# Altium project Kello.PrjPCB
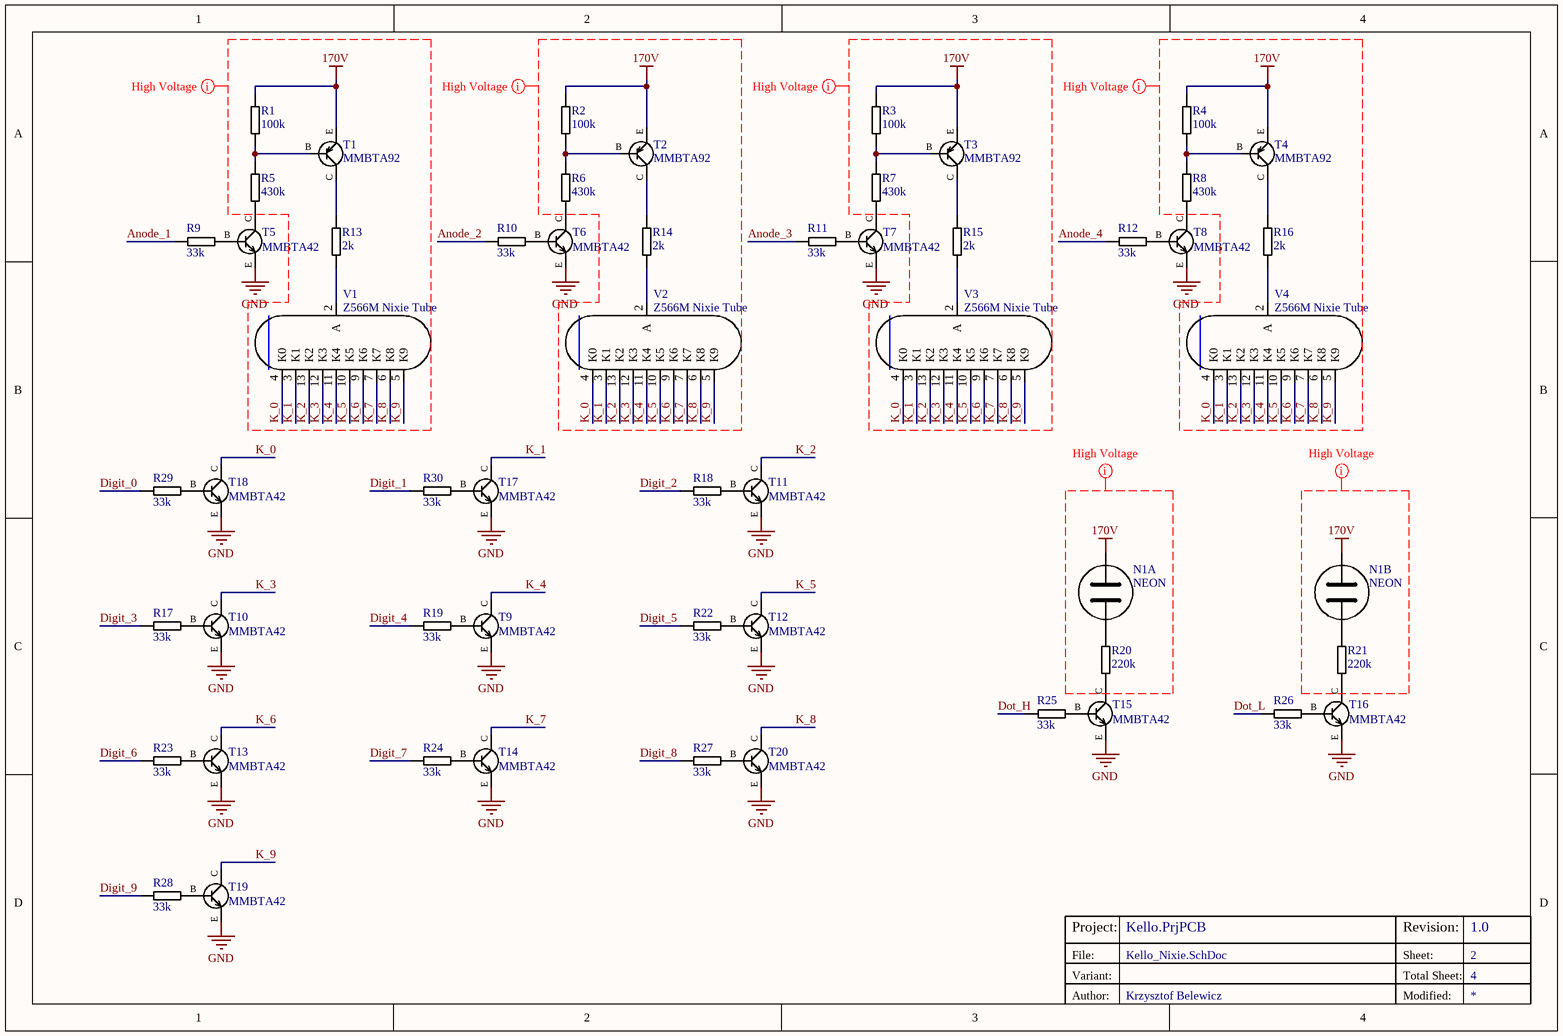
[diagram p0: Kello_Nixie.SchDoc]
4 sheets, 142 parts. Net scope: global (net labels, ports and power ports of the same name join across sheets).
Board file: Kello.PcbDoc
Sheets:
  Kello_Nixie.SchDoc
  Kello_uC.SchDoc
  Kello_Mechanical.SchDoc
  Kello_Nixie_PWR.SchDoc

## Sheet Kello_Nixie.SchDoc
size A4; ApprovedBy: Krzysztof Belewicz; CheckedBy: Krzysztof Belewicz; Author: Krzysztof Belewicz; DrawnBy: Krzysztof Belewicz; Engineer: Krzysztof Belewicz; Revision: 1.0; SheetNumber: 2; SheetTotal: 4

### Parts
N1  NEON  [NEON-9]  (parts A,B of 2)
R1  value 100k  [RESC1608N]  (hidden comment: Resistor)
R2  value 100k  [RESC1608N]  (hidden comment: Resistor)
R3  value 100k  [RESC1608N]  (hidden comment: Resistor)
R4  value 100k  [RESC1608N]  (hidden comment: Resistor)
R5  value 430k  [RESC1608N]  (hidden comment: Resistor)
R6  value 430k  [RESC1608N]  (hidden comment: Resistor)
R7  value 430k  [RESC1608N]  (hidden comment: Resistor)
R8  value 430k  [RESC1608N]  (hidden comment: Resistor)
R9  value 33k  [RESC1608N]  (hidden comment: Resistor)
R10  value 33k  [RESC1608N]  (hidden comment: Resistor)
R11  value 33k  [RESC1608N]  (hidden comment: Resistor)
R12  value 33k  [RESC1608N]  (hidden comment: Resistor)
R13  value 2k  [RESC1608N]  (hidden comment: Resistor)
R14  value 2k  [RESC1608N]  (hidden comment: Resistor)
R15  value 2k  [RESC1608N]  (hidden comment: Resistor)
R16  value 2k  [RESC1608N]  (hidden comment: Resistor)
R17  value 33k  [RESC1608N]  (hidden comment: Resistor)
R18  value 33k  [RESC1608N]  (hidden comment: Resistor)
R19  value 33k  [RESC1608N]  (hidden comment: Resistor)
R20  value 220k  [RESC1608N]  (hidden comment: Resistor)
R21  value 220k  [RESC1608N]  (hidden comment: Resistor)
R22  value 33k  [RESC1608N]  (hidden comment: Resistor)
R23  value 33k  [RESC1608N]  (hidden comment: Resistor)
R24  value 33k  [RESC1608N]  (hidden comment: Resistor)
R25  value 33k  [RESC1608N]  (hidden comment: Resistor)
R26  value 33k  [RESC1608N]  (hidden comment: Resistor)
R27  value 33k  [RESC1608N]  (hidden comment: Resistor)
R28  value 33k  [RESC1608N]  (hidden comment: Resistor)
R29  value 33k  [RESC1608N]  (hidden comment: Resistor)
R30  value 33k  [RESC1608N]  (hidden comment: Resistor)
T1  MMBTA92  [SOT23-3N]
T2  MMBTA92  [SOT23-3N]
T3  MMBTA92  [SOT23-3N]
T4  MMBTA92  [SOT23-3N]
T5  MMBTA42  [SOT23-3N]
T6  MMBTA42  [SOT23-3N]
T7  MMBTA42  [SOT23-3N]
T8  MMBTA42  [SOT23-3N]
T9  MMBTA42  [SOT23-3N]
T10  MMBTA42  [SOT23-3N]
T11  MMBTA42  [SOT23-3N]
T12  MMBTA42  [SOT23-3N]
T13  MMBTA42  [SOT23-3N]
T14  MMBTA42  [SOT23-3N]
T15  MMBTA42  [SOT23-3N]
T16  MMBTA42  [SOT23-3N]
T17  MMBTA42  [SOT23-3N]
T18  MMBTA42  [SOT23-3N]
T19  MMBTA42  [SOT23-3N]
T20  MMBTA42  [SOT23-3N]
V1  Z566M Nixie Tube  [Z566M]
V2  Z566M Nixie Tube  [Z566M]
V3  Z566M Nixie Tube  [Z566M]
V4  Z566M Nixie Tube  [Z566M]

### Nets
170V: N1.2 R1.1 R2.1 R3.1 R4.1 T1.E T2.E T3.E T4.E
GND: T5.E T6.E T7.E T8.E T9.E T10.E T11.E T12.E T13.E T14.E T15.E T16.E T17.E T18.E T19.E T20.E
Anode_1: R9.1
Anode_2: R10.1
Anode_3: R11.1
Anode_4: R12.1
Digit_0: R29.1
Digit_1: R30.1
Digit_2: R18.1
Digit_3: R17.1
Digit_4: R19.1
Digit_5: R22.1
Digit_6: R23.1
Digit_7: R24.1
Digit_8: R27.1
Digit_9: R28.1
Dot_H: R25.1
Dot_L: R26.1
K_0: T18.C V1.4(K0) V2.4(K0) V3.4(K0) V4.4(K0)
K_1: T17.C V1.3(K1) V2.3(K1) V3.3(K1) V4.3(K1)
K_2: T11.C V1.13(K2) V2.13(K2) V3.13(K2) V4.13(K2)
K_3: T10.C V1.12(K3) V2.12(K3) V3.12(K3) V4.12(K3)
K_4: T9.C V1.11(K4) V2.11(K4) V3.11(K4) V4.11(K4)
K_5: T12.C V1.10(K5) V2.10(K5) V3.10(K5) V4.10(K5)
K_6: T13.C V1.9(K6) V2.9(K6) V3.9(K6) V4.9(K6)
K_7: T14.C V1.7(K7) V2.7(K7) V3.7(K7) V4.7(K7)
K_8: T20.C V1.6(K8) V2.6(K8) V3.6(K8) V4.6(K8)
K_9: T19.C V1.5(K9) V2.5(K9) V3.5(K9) V4.5(K9)
NetN1_1: N1.1 R20.1
NetN1_3: N1.3 R21.1
NetR1_2: R1.2 R5.1 T1.B
NetR2_2: R2.2 R6.1 T2.B
NetR3_2: R3.2 R7.1 T3.B
NetR4_2: R4.2 R8.1 T4.B
NetR5_2: R5.2 T5.C
NetR6_2: R6.2 T6.C
NetR7_2: R7.2 T7.C
NetR8_2: R8.2 T8.C
NetR9_2: R9.2 T5.B
NetR10_2: R10.2 T6.B
NetR11_2: R11.2 T7.B
NetR12_2: R12.2 T8.B
NetR13_1: R13.1 T1.C
NetR13_2: R13.2 V1.2(A)
NetR14_1: R14.1 T2.C
NetR14_2: R14.2 V2.2(A)
NetR15_1: R15.1 T3.C
NetR15_2: R15.2 V3.2(A)
NetR16_1: R16.1 T4.C
NetR16_2: R16.2 V4.2(A)
NetR17_2: R17.2 T10.B
NetR18_2: R18.2 T11.B
NetR19_2: R19.2 T9.B
NetR20_2: R20.2 T15.C
NetR21_2: R21.2 T16.C
NetR22_2: R22.2 T12.B
NetR23_2: R23.2 T13.B
NetR24_2: R24.2 T14.B
NetR25_2: R25.2 T15.B
NetR26_2: R26.2 T16.B
NetR27_2: R27.2 T20.B
NetR28_2: R28.2 T19.B
NetR29_2: R29.2 T18.B
NetR30_2: R30.2 T17.B

### Layout directives
rule Clearance Constraint [Clearance = 19.685mil]; net class HIGH VOLTAGE: 170V, K_0, K_1, K_2, K_3, K_4, K_5, K_6, K_7, K_8, K_9

### Notes on the sheet
- Project:
- Variant:
- File:
- Sheet:
- Revision:
- Total Sheet:
- Author:
- Modified:

### Library data of the parts
N1 = NEON-9: Neon Tube; Supplier 1: TME; Supplier Part Number 1: NEON-9
R1-R4 = Resistor: Manufacturer 1: VISHAY; Manufacturer Part Number 1: CRCW0603100KFKEA; Tolerance: 1%; Power: 0.1W; Supplier 1: TME; Supplier Part Number 1: CRCW0603100KFKEA
R5-R12 R17-R30 = Resistor: Tolerance: 1%; Power: *; Supplier 1: TME; Supplier 2: *
  R5-R8: Supplier Part Number 1: SMD0603-430k
  R9-R12 R17-R19 R22-R30: Supplier Part Number 1: SMD0603-33k
  R20 R21: Supplier Part Number 1: SMD0603-220k
R13-R16 = Resistor: Manufacturer 1: ROYAL OHM; Manufacturer Part Number 1: 0603SAF2001T5E; Tolerance: 1%; Power: 0.1W; Supplier 1: TME; Supplier Part Number 1: SMD0603-2K-1%
T1-T4 = 2N5087: PNP Transistor; pin to pad: B>1 C>3 E>2; Supplier 1: TME; Supplier Part Number 1: MMBTA92
T5-T20 = 2N3707: NPN Transistor; pin to pad: B>1 C>3 E>2; Supplier 1: TME; Supplier Part Number 1: MMBTA42LT1G
V1-V4 = Z566M

## Sheet Kello_uC.SchDoc
size A4; ApprovedBy: Krzysztof Belewicz; CheckedBy: Krzysztof Belewicz; Author: Krzysztof Belewicz; DrawnBy: Krzysztof Belewicz; Engineer: Krzysztof Belewicz; Revision: 1.0; SheetNumber: 1; SheetTotal: 4
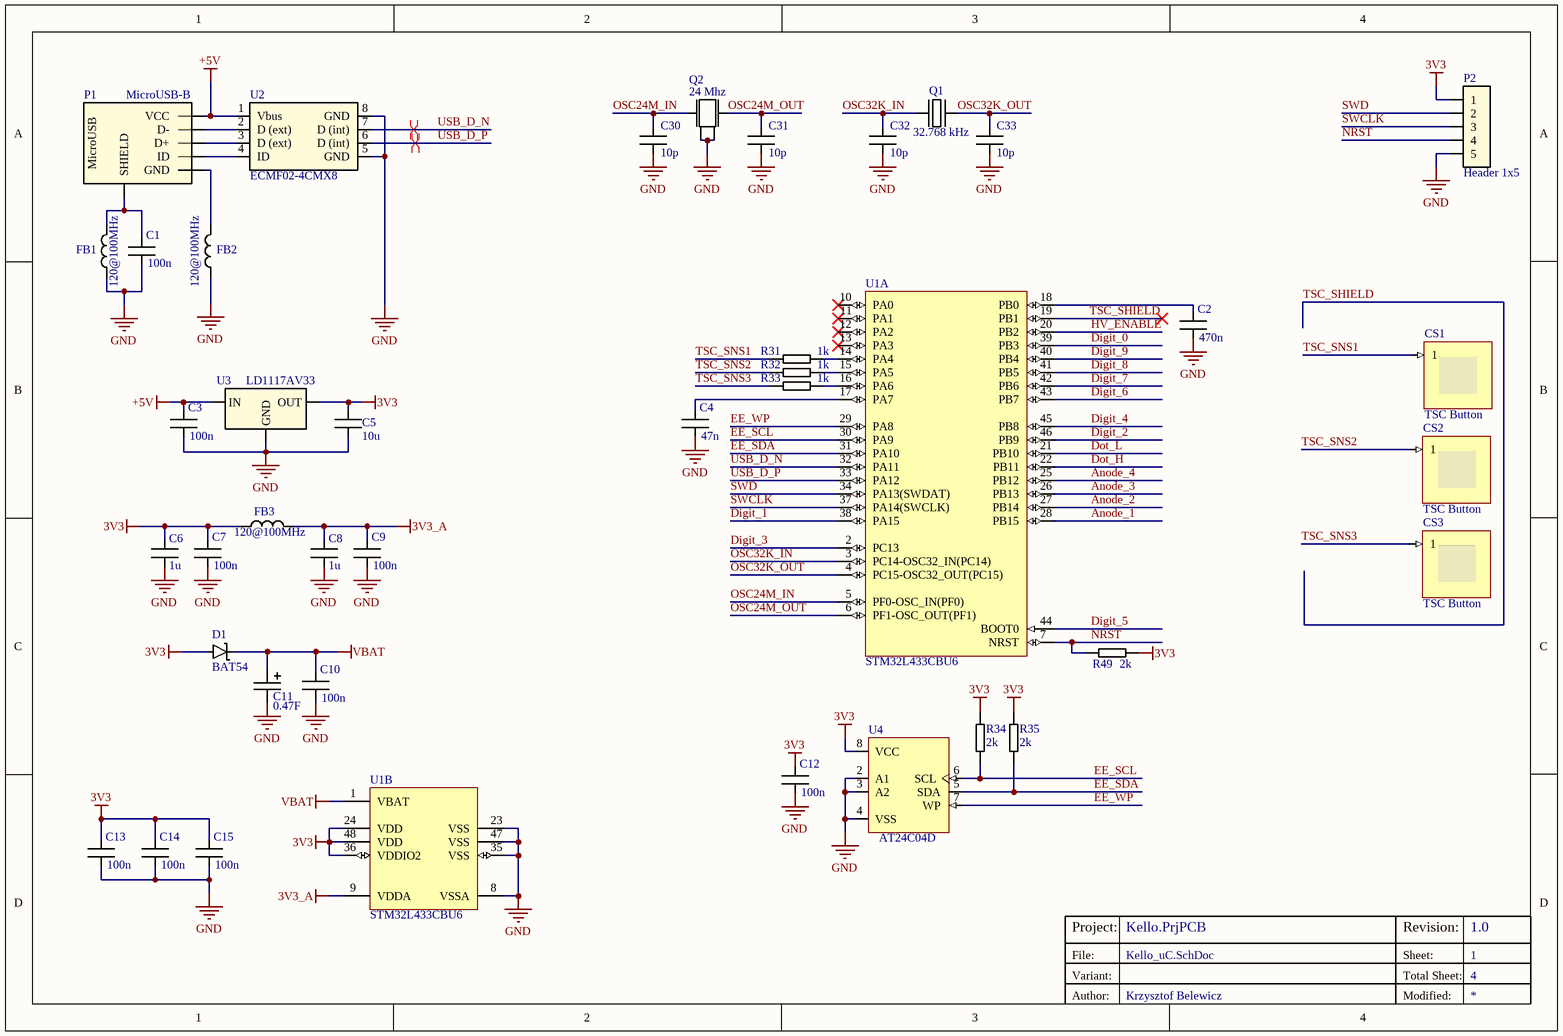
[diagram p1: Kello_uC.SchDoc]

### Parts
C1  value 100n  [CAPC1608N]  (hidden comment: Capacitor)
C2  value 470n  [CAPC1608N]  (hidden comment: Capacitor)
C3  value 100n  [CAPC1608N]  (hidden comment: Capacitor)
C4  value 47n  [CAPC1608N]  (hidden comment: Capacitor)
C5  value 10u  [CAPC1608N]  (hidden comment: Capacitor)
C6  value 1u  [CAPC1608N]  (hidden comment: Capacitor)
C7  value 100n  [CAPC1608N]  (hidden comment: Capacitor)
C8  value 1u  [CAPC1608N]  (hidden comment: Capacitor)
C9  value 100n  [CAPC1608N]  (hidden comment: Capacitor)
C10  value 100n  [CAPC1608N]  (hidden comment: Capacitor)
C11  0.47F  [FGH0V474ZF]
C12  value 100n  [CAPC1608N]  (hidden comment: Capacitor)
C13  value 100n  [CAPC1608N]  (hidden comment: Capacitor)
C14  value 100n  [CAPC1608N]  (hidden comment: Capacitor)
C15  value 100n  [CAPC1608N]  (hidden comment: Capacitor)
C30  10p  [CAPC1005N]
C31  10p  [CAPC1005N]
C32  10p  [CAPC1005N]
C33  10p  [CAPC1005N]
CS1  TSC Button  (no BOM)
CS2  TSC Button  (no BOM)
CS3  TSC Button  (no BOM)
D1  BAT54  [SOD-523F]
FB1  value 120@100MHz  [INDC1608N]  (hidden comment: Ferrite Bead)
FB2  value 120@100MHz  [INDC1608N]  (hidden comment: Ferrite Bead)
FB3  value 120@100MHz  [INDC1608N]  (hidden comment: Ferrite Bead)
P1  MicroUSB-B  [MicroUSB-B (47346-0001)]
P2  Header 1x5  [Header 1x5, Male, 2.54mm, Straight, THT]
Q1  value 32.768 kHz  [IL3X2]  (hidden comment: Crystal 2 pin)
Q2  value 24 Mhz  [CFPX-5]  (hidden comment: 24Mhz)
R31  value 1k  [RESC1608N]  (hidden comment: Resistor)
R32  value 1k  [RESC1608N]  (hidden comment: Resistor)
R33  value 1k  [RESC1608N]  (hidden comment: Resistor)
R34  value 2k  [RESC1608N]  (hidden comment: Resistor)
R35  value 2k  [RESC1608N]  (hidden comment: Resistor)
R49  value 2k  [RESC1608N]  (hidden comment: Resistor)
U1  STM32L433CBU6  [STM-UFQFPN48_L]  (parts A,B of 2)
U2  ECMF02-4CMX8  [uQFN-8]
U3  LD1117AV33  [SOT223_N]
U4  AT24C04D  [DFN-MC8]

### Nets
3V3: C5.2 C6.2 C7.2 C12.2 C13.2 C14.2 C15.2 D1.A FB3.1 P2.1 R34.1 R35.1 R49.2 U1.24(VDD) U1.36(VDDIO2) U1.48(VDD) U3.2(OUT) U4.8(VCC)
3V3_A: C8.2 C9.2 FB3.2 U1.9(VDDA)
+5V: C3.2 P1.1(VCC) U2.1(Vbus) U3.3(IN)
GND: C1.1 C2.1 C3.1 C4.1 C5.1 C6.1 C7.1 C8.1 C9.1 C10.1 C11.2 C12.1 C13.1 C14.1 C15.1 C30.1 C31.1 C32.1 C33.1 FB1.2 FB2.2 P2.5 Q2.2 Q2.4 U1.8(VSSA) U1.23(VSS) U1.35(VSS) U1.47(VSS) U2.5(GND) U2.8(GND) U3.1(GND) U4.2(A1) U4.3(A2) U4.4(VSS)
VBAT: C10.2 C11.1 D1.K U1.1(VBAT)
Anode_1: U1.28(PB15)
Anode_2: U1.27(PB14)
Anode_3: U1.26(PB13)
Anode_4: U1.25(PB12)
Digit_0: U1.39(PB3)
Digit_1: U1.38(PA15)
Digit_2: U1.46(PB9)
Digit_3: U1.2(PC13)
Digit_4: U1.45(PB8)
Digit_5: U1.44(BOOT0)
Digit_6: U1.43(PB7)
Digit_7: U1.42(PB6)
Digit_8: U1.41(PB5)
Digit_9: U1.40(PB4)
Dot_H: U1.22(PB11)
Dot_L: U1.21(PB10)
EE_SCL: R34.2 U1.30(PA9) U4.6(SCL)
EE_SDA: R35.2 U1.31(PA10) U4.5(SDA)
EE_WP: U1.29(PA8) U4.7(WP)
HV_ENABLE: U1.20(PB2)
NRST: P2.4 R49.1 U1.7(NRST)
OSC24M_IN: C30.2 Q2.1 U1.5(PF0-OSC_IN(PF0))
OSC24M_OUT: C31.2 Q2.3 U1.6(PF1-OSC_OUT(PF1))
OSC32K_IN: C32.2 Q1.1 U1.3(PC14-OSC32_IN(PC14))
OSC32K_OUT: C33.2 Q1.2 U1.4(PC15-OSC32_OUT(PC15))
SWCLK: P2.3 U1.37(PA14(SWCLK))
SWD: P2.2 U1.34(PA13(SWDAT))
TSC_SHIELD: U1.19(PB1)
TSC_SNS1: CS1.1 R31.1
TSC_SNS2: CS2.1 R32.1
TSC_SNS3: CS3.1 R33.1
USB_D_N: U1.32(PA11) U2.7(D_(int))
USB_D_P: U1.33(PA12) U2.6(D_(int))
NetC1_2: C1.2 FB1.1 P1.6(SHIELD)
NetC2_2: C2.2 U1.18(PB0)
NetC4_2: C4.2 U1.17(PA7)
NetFB2_1: FB2.1 P1.5(GND)
NetP1_2: P1.2(D-) U2.2(D_(ext))
NetP1_3: P1.3(D+) U2.3(D_(ext))
NetP1_4: P1.4(ID) U2.4(ID)
NetR31_2: R31.2 U1.14(PA4)
NetR32_2: R32.2 U1.15(PA5)
NetR33_2: R33.2 U1.16(PA6)

Not connected (* = marked no-connect by the designer): U1 10(PA0)* 11(PA1)* 12(PA2)* 13(PA3)*

### Layout directives
differential pair: USB_D_N, USB_D_P

### Notes on the sheet
- Project:
- Variant:
- File:
- Sheet:
- Revision:
- Total Sheet:
- Author:
- Modified:
- (in symbol 47346-0001) MicroUSB

### Library data of the parts
C1 C3 C7 C9 C10 C12-C15 = Capacitor: Manufacturer Part Number 1: CL10F104ZA8NNNC; Manufacturer 1: SAMSUNG; Tolerance: -20/+80%; MaxVoltage: 25V; Supplier 1: TME; Supplier Part Number 1: CL10F104ZA8NNNC
C2 = Capacitor: Manufacturer Part Number 1: 0603B474K100CT; Manufacturer 1: WALSIN; Tolerance: 10%; MaxVoltage: 10V; Supplier 1: Farnell; Supplier Part Number 1: 2524844
C4 = Capacitor: Manufacturer Part Number 1: VJ0603Y473KXJCW1BC; Manufacturer 1: VISHAY; Tolerance: 10%; MaxVoltage: 16V; Supplier 1: TME; Supplier Part Number 1: VJ0603Y473KXJCW1BC
C5 = Capacitor: Manufacturer Part Number 1: GRM188R60J106ME47D; Manufacturer 1: MURATA; Tolerance: 20%; MaxVoltage: 6.3V; Supplier 1: TME; Supplier Part Number 1: GRM188R60J106ME47D
C6 C8 = Capacitor: Manufacturer Part Number 1: GCM188R71E105KA64D; Manufacturer 1: MURATA; Tolerance: 10%; MaxVoltage: 25V; Supplier 1: TME; Supplier Part Number 1: GCM188R71E105KA64D
C11 = FGH0V474ZF: Kondensator: elektrolityczny; 0.47F; 3,5VDC; ESR:25Ω; SMD; -20÷+80%; Manufacturer 1: KEMET; Max Voltage: 3.5V; ESR: 25Ohm; Supplier 1: TME; Manufacturer Part Number 1: FGH0V474ZF; Supplier Part Number 1: FGH0V474ZF; Value: 0.47F
C30-C33 = Capacitor: Manufacturer Part Number 1: VJ0603A100FXACW1BC; Manufacturer 1: VISHAY; Tolerance: 1%; MaxVoltage: 50V; Supplier 1: Farnell; Supplier 2: TME; Value: 10p; Supplier Part Number 1: 2896354; Manufacturer 2: VISHAY; Manufacturer Part Number 2: VJ0603A100FXACW1BC; Supplier Part Number 2: VJ0603A100FXACW1BC
CS1-CS3 = QTouchButton: QTouch Button; ConfiguratorName: ATMEL_TOUCH; ConfigurationParameters: {}__sensorid[1]{}width[15]{}height[15]{}
D1 = BAT54XV2: Fairchild BAT54XV2, Schottky, 200mA, 30V; Supplier 1: Farnell; Supplier Part Number 1: 2322476; Forward Current: 200mA; Max Reverse Voltage: 30V; Manufacturer: Fairchild; Manufacturer Part Number: BAT54XV2; Supplier 2: RS-Components; Supplier Part Number 2: 690-0029
FB1-FB3 = Inductor: Max Current: 3A; Tolerance: *; Supplier 1: TME; Supplier 2: *; Supplier Part Number 1: BLM18KG121TN1D
P1 = 47346-0001: Molex MicroUSB-B, SMD (P/N 47346-0001); Manufacturer Part Number 1: 473460001; Supplier 1: TME; Supplier Part Number 1: MX-47346-0001; Manufacturer 1: MOLEX
P2 = Header 1x5: Pin header, 1x5, 2.54mm; Supplier Part Number 1: *; Supplier 1: *
Q1 = Crystal 2 pin: Manufacturer 1: ILSI; Manufacturer Part Number 1: IL3X2-HX5F12.5-32.768KHZ; Supplier Part Number 1: IL3X2-HX5F12.5-32.768KHZ; Supplier 1: TME
Q2 = Crystal 4 pin: Manufacturer Part Number 1: 3225-24M-SR; Manufacturer 1: SR PASSIVES; Supplier 1: TME; Supplier Part Number 1: 3225-24M-SR
R31-R33 = Resistor: Manufacturer 1: ROYAL OHM; Manufacturer Part Number 1: 0603SAF1001T5E; Tolerance: 1%; Power: 0.1W; Supplier 1: TME; Supplier Part Number 1: SMD0603-1K-1%
R34 R35 R49 = Resistor: as R13 on sheet Kello_Nixie; Supplier 1: TME; Supplier Part Number 1: SMD0603-2K-1%
U1 = STM32L433CBU6: ARM Cortex-M4 32-bit MCU, 128 KB Flash, 64 KB Internal RAM, 38 I/Os, 48-pin UFQFPN, -40 to 85 degC; FLASH Size (Prog) (kB): 128; I/Os (High Current): 38; Internal RAM Size (kB): 64; Operating Frequency(F) (Processor speed) (MHz): 48; Packing: Tray; Supply Voltage(Vcc) min (V): 2; DatasheetVersion: Rev. 3; PackageVersion: Rev. 6, 06/2013; PackageReference: UFQFPN48; PackageDescription: 48-Pin Low Profile Quad Flat Package, 7 x 7 mm Body, 0.5 mm Pitch; Supplier 1: Farnell; Supplier Part Number 1: 2855693; Core: ARM Cortex-M4; Mounting Technology: Surface Mount; PartNumber: STM32L433CBU6; ComponentLink1Description: Manufacturer URL; ComponentLink1URL: http://www.st.com/web/en/home.html; ComponentLink3Description: Package Specification; ComponentLink3URL: http://www.st.com/st-web-ui/static/active/en/resource/technical/document/datasheet/DM00058181.pdf
U2 = ECMF02-4CMX8: STMicroelectronics Common Mode Filter with ESD protection, USB compatible; Supplier 1: Farnell; Supplier Part Number 1: 2629721; Manufacturer: STMicroelectronics; Manufacturer Part Number: ECMF02-4CMX8
U3 = LD1117AS33TR: Stabilizator napięcia; LDO, liniowy, nieregulowany; 3,3V; 1A; SMD; Manufacturer 1: ST MICROELECTRONICS; Output Voltage: 3.3V; Supplier Part Number 1: LD1117AS33; Supplier 1: TME; Max Current: 1A; Manufacturer Part Number 1: LD1117AS33TR
U4 = AT24C04D-MAHM-T: 4Kbit, 1MHz, 1.7V-3.6V, I2C Serial EEPROM, 8-Pin DFN, Industrial Temperature, Tape and Reel; Manufacturer 1: MICROCHIP; PackageReference: DFN-MC8; Manufacturer Part Number 1: AT24C04D-MAHM-T; Supplier 1: TME; Supplier Part Number 1: AT24C04D-MAHM-T

## Sheet Kello_Mechanical.SchDoc
size A4; ApprovedBy: Krzysztof Belewicz; CheckedBy: Krzysztof Belewicz; Author: Krzysztof Belewicz; DrawnBy: Krzysztof Belewicz; Engineer: Krzysztof Belewicz; Revision: 1.0; SheetNumber: 4; SheetTotal: 4
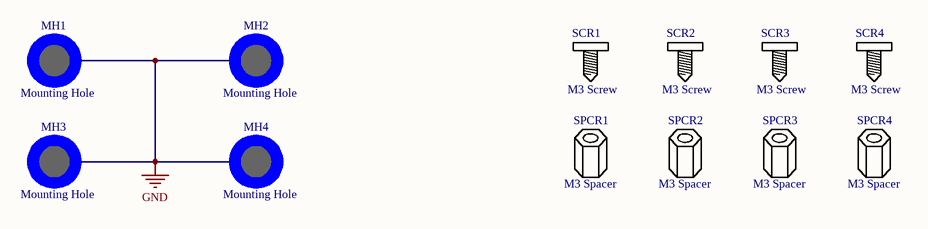
[diagram p2: Kello_Mechanical.SchDoc]

### Parts
MH1  Mounting Hole  [MH-M3_Copper]  (no BOM)
MH2  Mounting Hole  [MH-M3_Copper]  (no BOM)
MH3  Mounting Hole  [MH-M3_Copper]  (no BOM)
MH4  Mounting Hole  [MH-M3_Copper]  (no BOM)
SCR1  M3 Screw  (mechanical)
SCR2  M3 Screw  (mechanical)
SCR3  M3 Screw  (mechanical)
SCR4  M3 Screw  (mechanical)
SPCR1  M3 Spacer  (mechanical)
SPCR2  M3 Spacer  (mechanical)
SPCR3  M3 Spacer  (mechanical)
SPCR4  M3 Spacer  (mechanical)

### Nets
GND: MH1.MH MH2.MH MH3.MH MH4.MH

### Notes on the sheet
- Project:
- Variant:
- File:
- Sheet:
- Revision:
- Total Sheet:
- Author:
- Modified:

### Library data of the parts
MH1-MH4 = MH: M3 mounting hole
SCR1-SCR4 = SCREW: Supplier 1: *; Manufacturer 1: *; Supplier Part Number 1: *; Manufacturer Part Number 1: *
SPCR1-SPCR4 = SPCR: Supplier 1: *; Manufacturer 1: *; Supplier Part Number 1: *; Manufacturer Part Number 1: *

## Sheet Kello_Nixie_PWR.SchDoc
size A4; ApprovedBy: Krzysztof Belewicz; CheckedBy: Krzysztof Belewicz; Author: Krzysztof Belewicz; DrawnBy: Krzysztof Belewicz; Engineer: Krzysztof Belewicz; Revision: 1.0; SheetNumber: 3; SheetTotal: 4
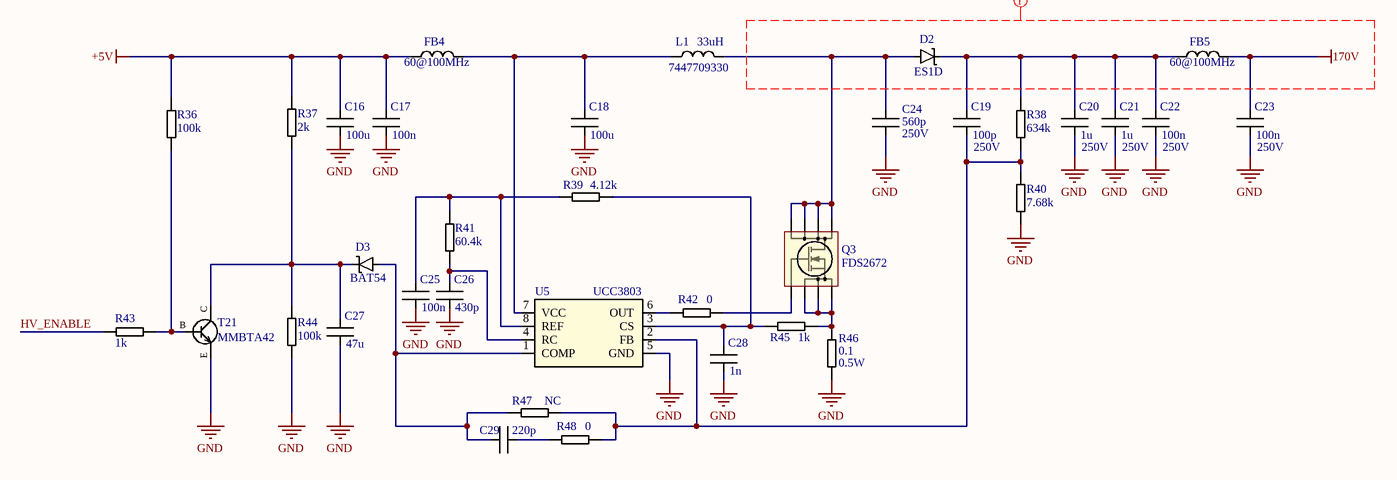
[diagram p3: Kello_Nixie_PWR.SchDoc]

### Parts
C16  value 100u  [CAPC4532N]  (hidden comment: Capacitor)
C17  value 100n  [CAPC1608N]  (hidden comment: Capacitor)
C18  value 100u  [CAPC4532N]  (hidden comment: Capacitor)
C19  value 100p  MaxVoltage: 250V  [CAPC1608N]  (hidden comment: Capacitor)
C20  value 1u  MaxVoltage: 250V  [CAPC4532N]  (hidden comment: Capacitor)
C21  value 1u  MaxVoltage: 250V  [CAPC4532N]  (hidden comment: Capacitor)
C22  value 100n  MaxVoltage: 250V  [CAPC3216N]  (hidden comment: Capacitor)
C23  value 100n  MaxVoltage: 250V  [CAPC3216N]  (hidden comment: Capacitor)
C24  value 560p  MaxVoltage: 250V  [CAPC1608N]  (hidden comment: Capacitor)
C25  value 100n  [CAPC1608N]  (hidden comment: Capacitor)
C26  value 430p  [CAPC1608N]  (hidden comment: Capacitor)
C27  value 47u  [CAPC3225N]  (hidden comment: Capacitor)
C28  value 1n  [CAPC1608N]  (hidden comment: Capacitor)
C29  value 220p  [CAPC1608N]  (hidden comment: Capacitor)
D2  ES1D  [SUB-SMA]
D3  BAT54  [SOD-523F]
FB4  value 60@100MHz  [INDC1608N]  (hidden comment: Ferrite Bead)
FB5  value 60@100MHz  [INDC1608N]  (hidden comment: Ferrite Bead)
L1  7447709330  value 33uH  [WE_PD]
Q3  FDS2672  [SO8_N]
R36  value 100k  [RESC1608N]  (hidden comment: Resistor)
R37  value 2k  [RESC1608N]  (hidden comment: Resistor)
R38  value 634k  [RESC3216N]  (hidden comment: Resistor)
R39  value 4.12k  [RESC1608N]  (hidden comment: Resistor)
R40  value 7.68k  [RESC3216N]  (hidden comment: Resistor)
R41  value 60.4k  [RESC1608N]  (hidden comment: Resistor)
R42  value 0  [RESC1608N]  (hidden comment: Resistor)
R43  value 1k  [RESC1608N]  (hidden comment: Resistor)
R44  value 100k  [RESC1608N]  (hidden comment: Resistor)
R45  value 1k  [RESC1608N]  (hidden comment: Resistor)
R46  value 0.1  Power: 0.5W  [RESC3216N]  (hidden comment: Resistor)
R47  value NC  [RESC1608N]  (hidden comment: Resistor)
R48  value 0  [RESC1608N]  (hidden comment: Resistor)
T21  MMBTA42  [SOT23-3N]
U5  UCC3803  [SOIC8+PAD (SOIC127P600X170_HS-9N)]

### Nets
170V: C23.2 FB5.2
+5V: C16.2 C17.2 FB4.1 R36.1 R37.1
GND: C16.1 C17.1 C18.1 C20.1 C21.1 C22.1 C23.1 C24.1 C25.1 C26.1 C27.1 C28.1 R40.2 R44.2 R46.2 T21.E U5.5(GND)
HV_ENABLE: R43.1
NetC18_2: C18.2 FB4.2 L1.1 U5.7(VCC)
NetC19_1: C19.1 R38.2 R40.1 R47.2 R48.2 U5.2(FB)
NetC19_2: C19.2 C20.2 C21.2 C22.2 D2.K FB5.1 R38.1
NetC24_2: C24.2 D2.A L1.2 Q3.5(D) Q3.6(D) Q3.7(D) Q3.8(D)
NetC25_2: C25.2 R39.1 R41.1 U5.8(REF)
NetC26_2: C26.2 R41.2 U5.4(RC)
NetC27_2: C27.2 D3.K R37.2 R44.1 T21.C
NetC28_2: C28.2 R39.2 R45.1 U5.3(CS)
NetC29_1: C29.1 R48.1
NetC29_2: C29.2 D3.A R47.1 U5.1(COMP)
NetQ3_1: Q3.1(S) Q3.2(S) Q3.3(S) R45.2 R46.1
NetQ3_4: Q3.4(G) R42.2
NetR36_2: R36.2 R43.2 T21.B
NetR42_1: R42.1 U5.6(OUT)

### Layout directives
rule Clearance Constraint [Clearance = 19.685mil]; net class HIGH VOLTAGE: 170V

### Notes on the sheet
- Project:
- Variant:
- File:
- Sheet:
- Revision:
- Total Sheet:
- Author:
- Modified:

### Library data of the parts
C16 C18 = Capacitor: Manufacturer Part Number 1: C4532X5R1A107M280KC; Manufacturer 1: TDK; Tolerance: 20%; MaxVoltage: 10V; Supplier 1: Farnell; Supplier Part Number 1: 2525204
C17 C25 = Capacitor: as C1 on sheet Kello_uC; Supplier 1: TME; Supplier Part Number 1: CL10F104ZA8NNNC
C19 = Capacitor: Manufacturer Part Number 1: 885342006003; Manufacturer 1: WURTH ELEKTRONIK; Tolerance: 5%; Supplier 1: Farnell; Supplier Part Number 1: 2812519
C20 C21 = Capacitor: Manufacturer Part Number 1: CGA8P3X7T2E105K250KA; Manufacturer 1: TDK; Tolerance: 10%; Supplier 1: Farnell; Supplier Part Number 1: 2435499
C22 C23 = Capacitor: Manufacturer Part Number 1: C1206C104KARECAUTO; Manufacturer 1: KEMET; Tolerance: 10%; Supplier 1: Farnell; Supplier Part Number 1: 2852360
C24 = Capacitor: Manufacturer Part Number 1: C0603C561JAGACAUTO; Manufacturer 1: KEMET; Tolerance: 5%; Supplier 1: Farnell; Supplier Part Number 1: 2810275
C26 = Capacitor: Manufacturer 1: KEMET; Manufacturer Part Number 1: C0603C431J5GACTU; Tolerance: 5%; MaxVoltage: 50V; Supplier 1: Farnell; Supplier Part Number 1: 2821196
C27 = Capacitor: Manufacturer 1: KEMET; Manufacturer Part Number 1: C1210C476M4PACTU; Tolerance: 20%; MaxVoltage: 16V; Supplier 1: Farnell; Supplier Part Number 1: 1838761
C28 = Capacitor: Manufacturer Part Number 1: VJ0603Y102KXACW1BC; Manufacturer 1: VISHAY; Tolerance: 10%; MaxVoltage: 50V; Supplier 1: TME; Supplier Part Number 1: VJ0603Y102KXACW1BC
C29 = Capacitor: Manufacturer Part Number 1: VJ0603Y221KXACW1BC; Manufacturer 1: VISHAY; Tolerance: 10%; MaxVoltage: 50V; Supplier 1: TME; Supplier Part Number 1: VJ0603Y221KXACW1BC
D2 = SS19L: Dioda: prostownicza; SMD; 200V; 1A; 15ns; 1,47W; SMA; Ifsm:30A; Manufacturer: ON SEMICONDUCTOR; Max Current: 1A; Max Reverse Voltage: 200V; Supplier 1: TME; Manufacturer Part Number: ES1D; Supplier Part Number 1: ES1D
D3 = BAT54XV2: Fairchild BAT54XV2, Schottky, 200mA, 30V; Supplier 1: Farnell; Supplier Part Number 1: 2322476; Forward Current: 200mA; Max Reverse Voltage: 30V; Manufacturer: Fairchild; Manufacturer Part Number: BAT54XV2; Supplier 2: RS-Components; Supplier Part Number 2: 690-0029
FB4 FB5 = Inductor: Manufacturer Part Number 1: BLM18BB600SN1D; Manufacturer 1: MURATA; Max Current: 0.55A; Supplier 1: TME; Supplier Part Number 1: BLM18BB600SN1D
L1 = 7447709330: Cewka zasilająca (SMD), 33 µH, 4.2 A, Osłonięte, 5.5 A, Seria WE-PD, 12mm x 12mm x 10mm; Manufacturer 1: WURTH ELEKTRONIK; Tolerance: 20%; Max Current RMS: 4.2A; Supplier 1: Farnell; Supplier Part Number 1: 2082654; Manufacturer Part Number 1: 7447709330
Q3 = FDS2672: Tranzystor: N-MOSFET; unipolarny; 200V; 3,9A; 2,5W; SO8; UltraFET®; Manufacturer 1: ON SEMICONDUCTOR (FAIRCHILD); Max Current: 3.9A; Supplier Part Number 1: FDS2672; Supplier 1: TME; Manufacturer Part Number 1: FDS2672; Max Voltage: 200V
R36 R44 = Resistor: as R1 on sheet Kello_Nixie; Supplier 1: TME; Supplier Part Number 1: CRCW0603100KFKEA
R37 = Resistor: as R13 on sheet Kello_Nixie; Supplier 1: TME; Supplier Part Number 1: SMD0603-2K-1%
R38 = Resistor: Manufacturer 1: VISHAY; Manufacturer Part Number 1: CRCW1206634KFKEA.; Tolerance: 1%; Power: 0.25W; Supplier 1: Farnell; Supplier Part Number 1: 2139670
R39 = Resistor: Manufacturer Part Number 1: CRCW06034K12FKEA; Manufacturer 1: VISHAY; Tolerance: 1%; Power: 0.1W; Supplier 1: Farnell; Supplier Part Number 1: 1652883
R40 = Resistor: Manufacturer 1: PANASONIC; Manufacturer Part Number 1: ERJ8ENF7681V; Tolerance: 1%; Power: 0.25W; Supplier 1: Farnell; Supplier Part Number 1: 2307849
R41 = Resistor: Manufacturer 1: VISHAY; Manufacturer Part Number 1: CRCW060360K4FKEA.; Tolerance: 1%; Power: 0.1W; Supplier 1: Farnell; Supplier Part Number 1: 2138476
R42 R48 = Resistor: Manufacturer Part Number 1: CRCW06030000Z0TABC; Manufacturer 1: VISHAY; Tolerance: 1%; Power: 0.1W; Supplier 1: TME; Supplier Part Number 1: CRCW06030000Z0TABC
R43 R45 = Resistor: as R31 on sheet Kello_uC; Supplier 1: TME; Supplier Part Number 1: SMD0603-1K-1%
R46 = Resistor: Manufacturer 1: WELWYN; Manufacturer Part Number 1: LR1206-R10FW; Tolerance: 1%; Supplier 1: Farnell; Supplier Part Number 1: 1099914
R47 = Resistor: Tolerance: 1%; Power: 0.1W; Supplier 1: *; Manufacturer 1: *; Supplier Part Number 1: *; Manufacturer Part Number 1: *
T21 = 2N3707: NPN Transistor; pin to pad: B>1 C>3 E>2; Supplier 1: TME; Supplier Part Number 1: MMBTA42LT1G
U5 = UCC3803: Kontroler PWM current mode, zasilanie 12V-3.6V, 1 MHz, wyjście 1V/1A, SOIC-8; Manufacturer Part Number 1: UCC3803D; Manufacturer 1: TEXAS INSTRUMENTS; Supplier 1: Farnell; Supplier Part Number 1: 2323690

## Nets that join several sheets
170V: Kello_Nixie (9 pins), Kello_Nixie_PWR (C23.2 FB5.2)
+5V: Kello_uC (C3.2 P1.1 U2.1 U3.3), Kello_Nixie_PWR (5 pins)
GND: Kello_Nixie (16 pins), Kello_uC (34 pins), Kello_Mechanical (MH1.MH MH2.MH MH3.MH MH4.MH), Kello_Nixie_PWR (17 pins)
Anode_1: Kello_Nixie (R9.1), Kello_uC (U1.28)
Anode_2: Kello_Nixie (R10.1), Kello_uC (U1.27)
Anode_3: Kello_Nixie (R11.1), Kello_uC (U1.26)
Anode_4: Kello_Nixie (R12.1), Kello_uC (U1.25)
Digit_0: Kello_Nixie (R29.1), Kello_uC (U1.39)
Digit_1: Kello_Nixie (R30.1), Kello_uC (U1.38)
Digit_2: Kello_Nixie (R18.1), Kello_uC (U1.46)
Digit_3: Kello_Nixie (R17.1), Kello_uC (U1.2)
Digit_4: Kello_Nixie (R19.1), Kello_uC (U1.45)
Digit_5: Kello_Nixie (R22.1), Kello_uC (U1.44)
Digit_6: Kello_Nixie (R23.1), Kello_uC (U1.43)
Digit_7: Kello_Nixie (R24.1), Kello_uC (U1.42)
Digit_8: Kello_Nixie (R27.1), Kello_uC (U1.41)
Digit_9: Kello_Nixie (R28.1), Kello_uC (U1.40)
Dot_H: Kello_Nixie (R25.1), Kello_uC (U1.22)
Dot_L: Kello_Nixie (R26.1), Kello_uC (U1.21)
HV_ENABLE: Kello_uC (U1.20), Kello_Nixie_PWR (R43.1)

## Assembly variants
Prototype: not fitted CS1 CS2 CS3